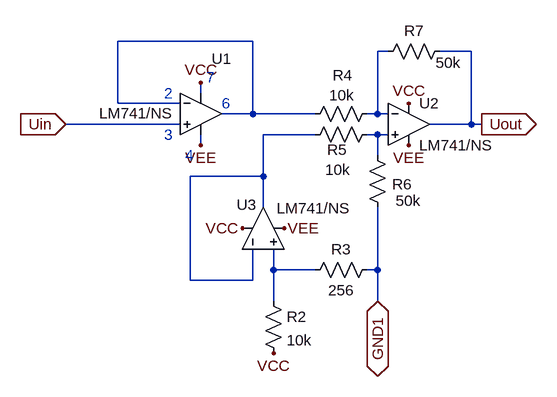
[diagram p0: schematic 1Signaalinkäsittelijä.asc]
1Signaalinkäsittelijä.asc, the LTspice schematic file:
Version 4.1
SHEET 1 888 680
WIRE 208 48 0 48
WIRE 416 64 400 64
WIRE 544 64 496 64
WIRE 128 128 128 112
WIRE 0 144 0 48
WIRE 96 144 0 144
WIRE 208 160 208 48
WIRE 208 160 160 160
WIRE 304 160 208 160
WIRE 400 160 400 64
WIRE 400 160 384 160
WIRE 416 160 400 160
WIRE 96 176 -80 176
WIRE 544 176 544 64
WIRE 544 176 480 176
WIRE 560 176 544 176
WIRE 304 192 224 192
WIRE 400 192 384 192
WIRE 416 192 400 192
WIRE 128 208 128 192
WIRE 400 224 400 192
WIRE 224 256 224 192
WIRE 224 256 112 256
WIRE 224 304 224 256
WIRE 240 400 240 368
WIRE 304 400 240 400
WIRE 400 400 400 304
WIRE 400 400 384 400
WIRE 112 416 112 256
WIRE 208 416 208 368
WIRE 208 416 112 416
WIRE 240 448 240 400
WIRE 400 448 400 400
FLAG 128 112 VCC
FLAG 128 208 VEE
FLAG 192 336 VCC
FLAG 448 144 VCC
FLAG 256 336 VEE
FLAG 448 208 VEE
FLAG 240 528 VCC
FLAG 560 176 Uout
IOPIN 560 176 Out
FLAG -80 176 Uin
IOPIN -80 176 In
FLAG 400 448 GND1
IOPIN 400 448 BiDir
SYMBOL Opamps\\opamp2 160 336 R270
WINDOW 0 36 23 VRight 2
WINDOW 3 31 199 VLeft 2
SYMATTR InstName U3
SYMATTR Value LM741/NS
SYMBOL Opamps\\opamp2 448 112 R0
SYMATTR InstName U2
SYMATTR Value LM741/NS
SYMBOL Opamps\\opamp2 128 96 R0
WINDOW 3 -156 63 Left 2
WINDOW 0 17 -21 Left 2
SYMATTR Value LM741/NS
SYMATTR InstName U1
SYMBOL res 224 432 R0
SYMATTR InstName R2
SYMATTR Value 10k
SYMBOL res 400 384 R90
WINDOW 0 0 56 VBottom 2
WINDOW 3 32 56 VTop 2
SYMATTR InstName R3
SYMATTR Value 256
SYMBOL res 400 144 R90
WINDOW 0 -28 54 VBottom 2
WINDOW 3 -28 55 VTop 2
SYMATTR InstName R4
SYMATTR Value 10k
SYMBOL res 400 176 R90
WINDOW 0 55 62 VBottom 2
WINDOW 3 54 61 VTop 2
SYMATTR InstName R5
SYMATTR Value 10k
SYMBOL res 416 320 R180
WINDOW 0 -37 52 Left 2
WINDOW 3 -51 26 Left 2
SYMATTR InstName R6
SYMATTR Value 50k
SYMBOL res 400 80 R270
WINDOW 0 32 56 VTop 2
WINDOW 3 14 109 VBottom 2
SYMATTR InstName R7
SYMATTR Value 50k
TEXT 72 128 Left 2 ;2
TEXT 72 192 Left 2 ;3
TEXT 160 144 Left 2 ;6
TEXT 136 104 Left 2 ;7
TEXT 104 224 Left 2 ;4

The netlist it stands for:
* 1Signaalinkäsittelijä.asc
X§U3 N005 N003 VCC VEE N003 LM741/NS  ; pins In+ In- V+ V- OUT
X§U2 N004 N002 VCC VEE Uout LM741/NS  ; pins In+ In- V+ V- OUT
X§U1 Uin N001 VCC VEE N001 LM741/NS  ; pins In+ In- V+ V- OUT
R2 N005 VCC 10k
R3 GND1 N005 256
R4 N002 N001 10k
R5 N004 N003 10k
R6 GND1 N004 50k
R7 N002 Uout 50k
* 2
* 3
* 6
* 7
* 4
.backanno
.end